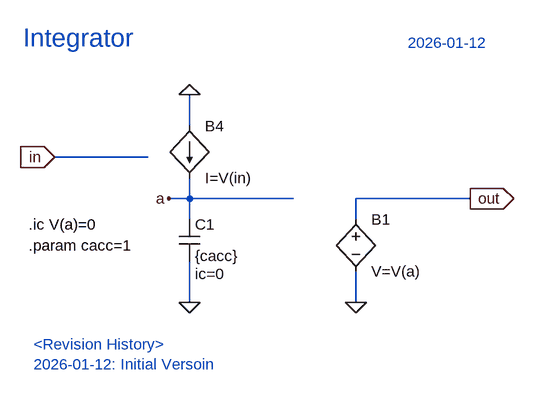
[diagram p0: schematic INTEGRATOR.asc]
INTEGRATOR.asc, the LTspice schematic file:
Version 4.1
SHEET 1 2304 924
WIRE 704 -64 704 -112
WIRE 640 -16 496 -16
WIRE 704 48 704 16
WIRE 704 48 672 48
WIRE 864 48 704 48
WIRE 1136 48 960 48
WIRE 704 80 704 48
WIRE 960 80 960 48
WIRE 704 208 704 144
WIRE 960 208 960 160
FLAG 496 -16 in
IOPIN 496 -16 In
FLAG 704 -112 0
FLAG 704 208 0
FLAG 1136 48 out
IOPIN 1136 48 Out
FLAG 672 48 a
FLAG 960 208 0
SYMBOL cap 688 80 R0
WINDOW 123 24 84 Left 2
SYMATTR Value2 ic=0
SYMATTR InstName C1
SYMATTR Value {cacc}
SYMBOL bv 960 64 R0
SYMATTR InstName B1
SYMATTR Value V=V(a)
SYMBOL bi 704 -64 R0
SYMATTR InstName B4
SYMATTR Value I=V(in)
TEXT 448 -200 Left 4 ;Integrator
TEXT 1040 -192 Left 2 ;2026-01-12
TEXT 464 272 Left 2 ;<Revision History>\n2026-01-12: Initial Versoin
TEXT 456 120 Left 2 !.param cacc=1
TEXT 456 88 Left 2 !.ic V(a)=0

The netlist it stands for:
* INTEGRATOR.asc
C1 a 0 {cacc} ic=0
B1 out 0 V=V(a)
B4 0 a I=V(in)
* Integrator
* 2026-01-12
* <Revision History>
* 2026-01-12: Initial Versoin
.param cacc=1
.ic V(a)=0
.backanno
.end